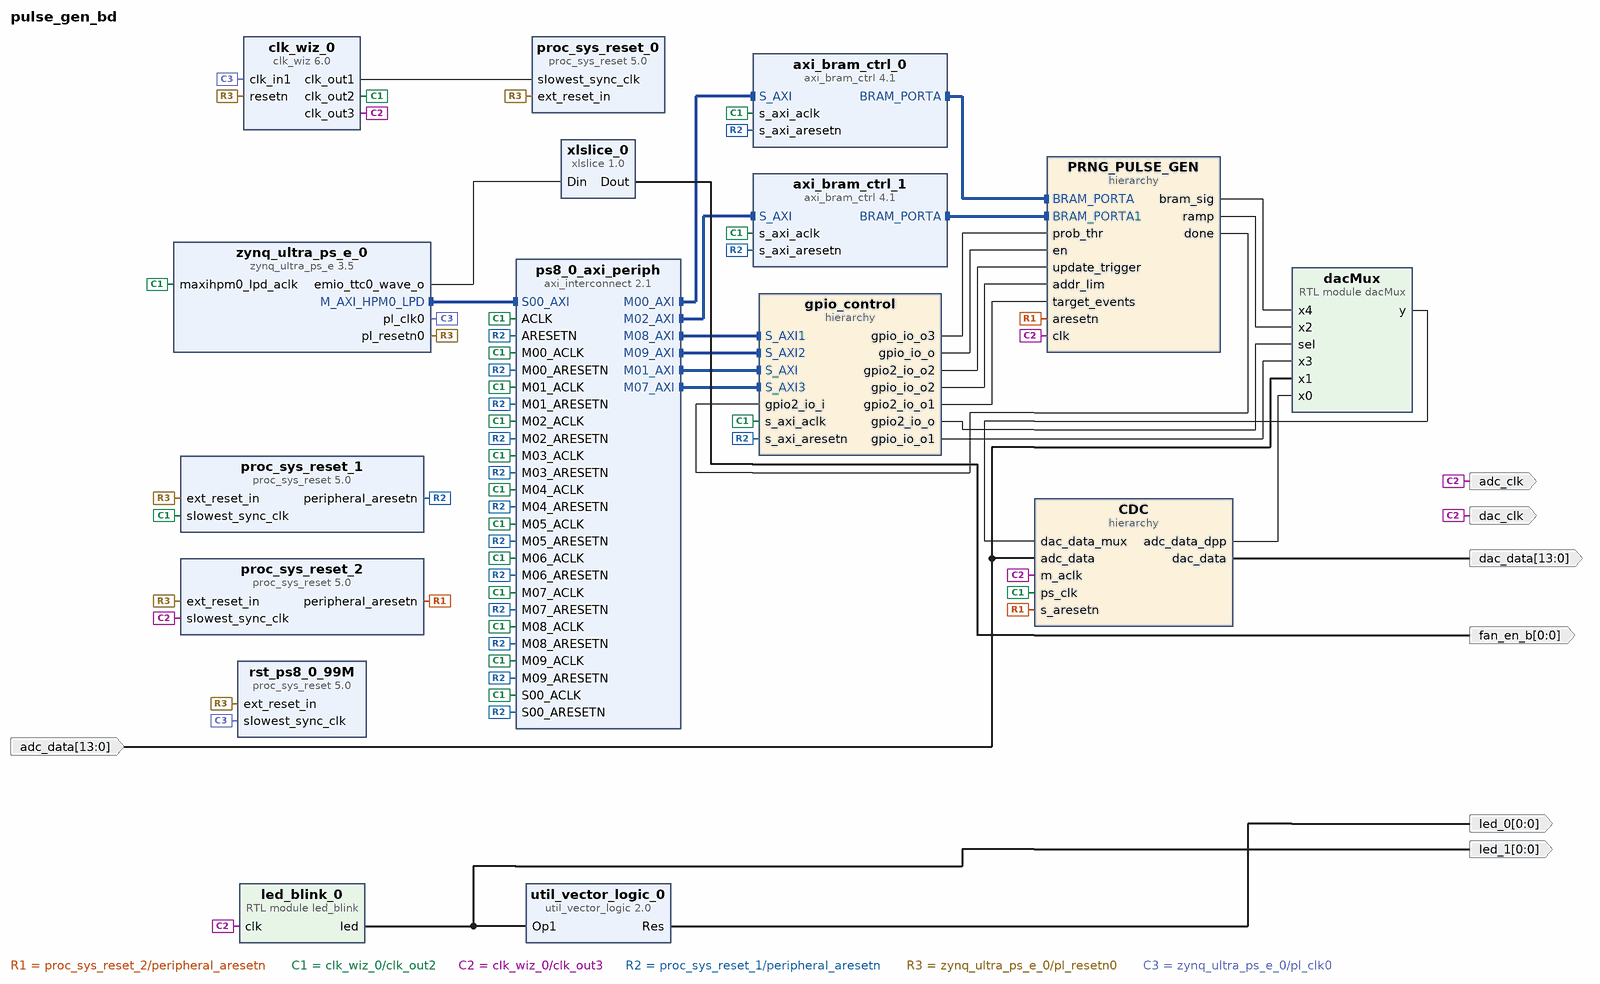
[diagram p0: block diagram of the top level]
# Vivado block design pulse_gen_bd, xck26-sfvc784-2LV-c, Vivado 2024.2
create_bd_design pulse_gen_bd

create_bd_port -dir O -from 0 -to 0 fan_en_b
create_bd_port -dir O -type clk adc_clk
create_bd_port -dir O -type clk dac_clk
create_bd_port -dir O -from 13 -to 0 dac_data
create_bd_port -dir O -from 0 -to 0 led_0
create_bd_port -dir I -from 13 -to 0 adc_data
create_bd_port -dir O -from 0 -to 0 led_1

create_bd_cell -type hier CDC
create_bd_cell -type ip -vlnv xilinx.com:ip:xlslice:1.0 xlslice_0
set_property -dict {CONFIG.DIN_FROM 2 CONFIG.DIN_TO 2 CONFIG.DIN_WIDTH 3} [get_bd_cells xlslice_0]
create_bd_cell -type module -reference dacMux dacMux
create_bd_cell -type ip -vlnv xilinx.com:ip:clk_wiz:6.0 clk_wiz_0
set_property -dict [list \
  CONFIG.CLKOUT1_JITTER 115.833 \
  CONFIG.CLKOUT1_PHASE_ERROR 87.181 \
  CONFIG.CLKOUT2_JITTER 102.087 \
  CONFIG.CLKOUT2_PHASE_ERROR 87.181 \
  CONFIG.CLKOUT2_REQUESTED_OUT_FREQ 200.000 \
  CONFIG.CLKOUT2_USED true \
  CONFIG.CLKOUT3_JITTER 132.685 \
  CONFIG.CLKOUT3_PHASE_ERROR 87.181 \
  CONFIG.CLKOUT3_REQUESTED_OUT_FREQ 50.000 \
  CONFIG.CLKOUT3_USED true \
  CONFIG.CLKOUT4_JITTER 188.587 \
  CONFIG.CLKOUT4_PHASE_ERROR 87.181 \
  CONFIG.CLKOUT4_REQUESTED_OUT_FREQ 100.000 \
  CONFIG.CLKOUT4_USED false \
  CONFIG.MMCM_CLKOUT1_DIVIDE 6 \
  CONFIG.MMCM_CLKOUT2_DIVIDE 24 \
  CONFIG.MMCM_CLKOUT3_DIVIDE 1 \
  CONFIG.NUM_OUT_CLKS 3 \
  CONFIG.RESET_PORT resetn \
  CONFIG.RESET_TYPE ACTIVE_LOW \
] [get_bd_cells clk_wiz_0]
create_bd_cell -type ip -vlnv xilinx.com:ip:util_vector_logic:2.0 util_vector_logic_0
set_property -dict {CONFIG.C_OPERATION not CONFIG.C_SIZE 1} [get_bd_cells util_vector_logic_0]
create_bd_cell -type module -reference led_blink led_blink_0
create_bd_cell -type hier PRNG_PULSE_GEN
create_bd_cell -type ip -vlnv xilinx.com:ip:zynq_ultra_ps_e:3.5 zynq_ultra_ps_e_0
set_property -dict [list \
  CONFIG.CAN0_BOARD_INTERFACE custom \
  CONFIG.CAN1_BOARD_INTERFACE custom \
  CONFIG.CSU_BOARD_INTERFACE custom \
  CONFIG.DP_BOARD_INTERFACE custom \
  CONFIG.GEM0_BOARD_INTERFACE custom \
  CONFIG.GEM1_BOARD_INTERFACE custom \
  CONFIG.GEM2_BOARD_INTERFACE custom \
  CONFIG.GEM3_BOARD_INTERFACE custom \
  CONFIG.GPIO_BOARD_INTERFACE custom \
  CONFIG.IIC0_BOARD_INTERFACE custom \
  CONFIG.IIC1_BOARD_INTERFACE custom \
  CONFIG.NAND_BOARD_INTERFACE custom \
  CONFIG.PCIE_BOARD_INTERFACE custom \
  CONFIG.PJTAG_BOARD_INTERFACE custom \
  CONFIG.PMU_BOARD_INTERFACE custom \
  CONFIG.PSU_BANK_0_IO_STANDARD LVCMOS18 \
  CONFIG.PSU_BANK_1_IO_STANDARD LVCMOS18 \
  CONFIG.PSU_BANK_2_IO_STANDARD LVCMOS18 \
  CONFIG.PSU_BANK_3_IO_STANDARD LVCMOS18 \
  CONFIG.PSU_USB3__DUAL_CLOCK_ENABLE 1 \
  CONFIG.PSU__CAN1__PERIPHERAL__ENABLE 0 \
  CONFIG.PSU__CRF_APB__ACPU_CTRL__FREQMHZ 1333.333 \
  CONFIG.PSU__CRF_APB__ACPU_CTRL__SRCSEL APLL \
  CONFIG.PSU__CRF_APB__APLL_CTRL__SRCSEL PSS_REF_CLK \
  CONFIG.PSU__CRF_APB__APLL_FRAC_CFG__ENABLED 1 \
  CONFIG.PSU__CRF_APB__DBG_FPD_CTRL__FREQMHZ 250 \
  CONFIG.PSU__CRF_APB__DBG_FPD_CTRL__SRCSEL IOPLL \
  CONFIG.PSU__CRF_APB__DBG_TRACE_CTRL__FREQMHZ 250 \
  CONFIG.PSU__CRF_APB__DBG_TRACE_CTRL__SRCSEL IOPLL \
  CONFIG.PSU__CRF_APB__DBG_TSTMP_CTRL__FREQMHZ 250 \
  CONFIG.PSU__CRF_APB__DBG_TSTMP_CTRL__SRCSEL IOPLL \
  CONFIG.PSU__CRF_APB__DDR_CTRL__FREQMHZ 1200 \
  CONFIG.PSU__CRF_APB__DDR_CTRL__SRCSEL DPLL \
  CONFIG.PSU__CRF_APB__DPDMA_REF_CTRL__FREQMHZ 600 \
  CONFIG.PSU__CRF_APB__DPDMA_REF_CTRL__SRCSEL APLL \
  CONFIG.PSU__CRF_APB__DPLL_CTRL__SRCSEL PSS_REF_CLK \
  CONFIG.PSU__CRF_APB__DP_AUDIO_REF_CTRL__SRCSEL RPLL \
  CONFIG.PSU__CRF_APB__DP_STC_REF_CTRL__SRCSEL RPLL \
  CONFIG.PSU__CRF_APB__DP_VIDEO_REF_CTRL__SRCSEL VPLL \
  CONFIG.PSU__CRF_APB__GDMA_REF_CTRL__FREQMHZ 600 \
  CONFIG.PSU__CRF_APB__GDMA_REF_CTRL__SRCSEL DPLL \
  CONFIG.PSU__CRF_APB__GPU_REF_CTRL__FREQMHZ 600 \
  CONFIG.PSU__CRF_APB__GPU_REF_CTRL__SRCSEL IOPLL \
  CONFIG.PSU__CRF_APB__TOPSW_LSBUS_CTRL__FREQMHZ 100 \
  CONFIG.PSU__CRF_APB__TOPSW_LSBUS_CTRL__SRCSEL IOPLL \
  CONFIG.PSU__CRF_APB__TOPSW_MAIN_CTRL__FREQMHZ 533.33 \
  CONFIG.PSU__CRF_APB__TOPSW_MAIN_CTRL__SRCSEL DPLL \
  CONFIG.PSU__CRF_APB__VPLL_CTRL__SRCSEL PSS_REF_CLK \
  CONFIG.PSU__CRL_APB__ADMA_REF_CTRL__FREQMHZ 500 \
  CONFIG.PSU__CRL_APB__ADMA_REF_CTRL__SRCSEL IOPLL \
  CONFIG.PSU__CRL_APB__CAN1_REF_CTRL__FREQMHZ 100 \
  CONFIG.PSU__CRL_APB__CAN1_REF_CTRL__SRCSEL IOPLL \
  CONFIG.PSU__CRL_APB__CPU_R5_CTRL__FREQMHZ 533.333 \
  CONFIG.PSU__CRL_APB__CPU_R5_CTRL__SRCSEL RPLL \
  CONFIG.PSU__CRL_APB__DBG_LPD_CTRL__FREQMHZ 250 \
  CONFIG.PSU__CRL_APB__DBG_LPD_CTRL__SRCSEL IOPLL \
  CONFIG.PSU__CRL_APB__GEM3_REF_CTRL__FREQMHZ 125 \
  CONFIG.PSU__CRL_APB__GEM3_REF_CTRL__SRCSEL IOPLL \
  CONFIG.PSU__CRL_APB__I2C0_REF_CTRL__FREQMHZ 100 \
  CONFIG.PSU__CRL_APB__I2C0_REF_CTRL__SRCSEL IOPLL \
  CONFIG.PSU__CRL_APB__I2C1_REF_CTRL__FREQMHZ 100 \
  CONFIG.PSU__CRL_APB__I2C1_REF_CTRL__SRCSEL IOPLL \
  CONFIG.PSU__CRL_APB__IOPLL_CTRL__SRCSEL PSS_REF_CLK \
  CONFIG.PSU__CRL_APB__IOU_SWITCH_CTRL__FREQMHZ 250 \
  CONFIG.PSU__CRL_APB__IOU_SWITCH_CTRL__SRCSEL IOPLL \
  CONFIG.PSU__CRL_APB__LPD_LSBUS_CTRL__FREQMHZ 100 \
  CONFIG.PSU__CRL_APB__LPD_LSBUS_CTRL__SRCSEL IOPLL \
  CONFIG.PSU__CRL_APB__LPD_SWITCH_CTRL__FREQMHZ 500 \
  CONFIG.PSU__CRL_APB__LPD_SWITCH_CTRL__SRCSEL IOPLL \
  CONFIG.PSU__CRL_APB__PCAP_CTRL__FREQMHZ 200 \
  CONFIG.PSU__CRL_APB__PCAP_CTRL__SRCSEL IOPLL \
  CONFIG.PSU__CRL_APB__PL0_REF_CTRL__FREQMHZ 100 \
  CONFIG.PSU__CRL_APB__PL0_REF_CTRL__SRCSEL IOPLL \
  CONFIG.PSU__CRL_APB__PL1_REF_CTRL__SRCSEL IOPLL \
  CONFIG.PSU__CRL_APB__QSPI_REF_CTRL__FREQMHZ 125 \
  CONFIG.PSU__CRL_APB__QSPI_REF_CTRL__SRCSEL IOPLL \
  CONFIG.PSU__CRL_APB__RPLL_CTRL__SRCSEL PSS_REF_CLK \
  CONFIG.PSU__CRL_APB__SDIO1_REF_CTRL__FREQMHZ 200 \
  CONFIG.PSU__CRL_APB__SDIO1_REF_CTRL__SRCSEL RPLL \
  CONFIG.PSU__CRL_APB__SPI1_REF_CTRL__SRCSEL IOPLL \
  CONFIG.PSU__CRL_APB__TIMESTAMP_REF_CTRL__FREQMHZ 100 \
  CONFIG.PSU__CRL_APB__TIMESTAMP_REF_CTRL__SRCSEL IOPLL \
  CONFIG.PSU__CRL_APB__UART0_REF_CTRL__FREQMHZ 100 \
  CONFIG.PSU__CRL_APB__UART0_REF_CTRL__SRCSEL IOPLL \
  CONFIG.PSU__CRL_APB__UART1_REF_CTRL__FREQMHZ 100 \
  CONFIG.PSU__CRL_APB__UART1_REF_CTRL__SRCSEL IOPLL \
  CONFIG.PSU__CRL_APB__USB0_BUS_REF_CTRL__FREQMHZ 250 \
  CONFIG.PSU__CRL_APB__USB0_BUS_REF_CTRL__SRCSEL IOPLL \
  CONFIG.PSU__CRL_APB__USB3_DUAL_REF_CTRL__FREQMHZ 20 \
  CONFIG.PSU__CRL_APB__USB3_DUAL_REF_CTRL__SRCSEL IOPLL \
  CONFIG.PSU__CRL_APB__USB3__ENABLE 0 \
  CONFIG.PSU__CSUPMU__PERIPHERAL__VALID 1 \
  CONFIG.PSU__DDRC__BUS_WIDTH {64 Bit} \
  CONFIG.PSU__DDRC__COMPONENTS Components \
  CONFIG.PSU__DDRC__DEVICE_CAPACITY {8192 MBits} \
  CONFIG.PSU__DDRC__DRAM_WIDTH {16 Bits} \
  CONFIG.PSU__DDRC__ECC Disabled \
  CONFIG.PSU__DDRC__MEMORY_TYPE {DDR 4} \
  CONFIG.PSU__DDRC__SPEED_BIN DDR4_2400R \
  CONFIG.PSU__DDR_HIGH_ADDRESS_GUI_ENABLE 1 \
  CONFIG.PSU__DDR__INTERFACE__FREQMHZ 600.000 \
  CONFIG.PSU__DEVICE_TYPE EV \
  CONFIG.PSU__DISPLAYPORT__PERIPHERAL__ENABLE 0 \
  CONFIG.PSU__DLL__ISUSED 0 \
  CONFIG.PSU__ENET1__GRP_MDIO__ENABLE 1 \
  CONFIG.PSU__ENET1__GRP_MDIO__IO {MIO 50 .. 51} \
  CONFIG.PSU__ENET1__PERIPHERAL__ENABLE 1 \
  CONFIG.PSU__ENET1__PERIPHERAL__IO {MIO 38 .. 49} \
  CONFIG.PSU__ENET3__PERIPHERAL__ENABLE 0 \
  CONFIG.PSU__FPGA_PL0_ENABLE 1 \
  CONFIG.PSU__FPGA_PL1_ENABLE 1 \
  CONFIG.PSU__GEM__TSU__ENABLE 0 \
  CONFIG.PSU__GPIO0_MIO__IO {MIO 0 .. 25} \
  CONFIG.PSU__GPIO0_MIO__PERIPHERAL__ENABLE 1 \
  CONFIG.PSU__GPIO1_MIO__IO {MIO 26 .. 51} \
  CONFIG.PSU__GPIO1_MIO__PERIPHERAL__ENABLE 1 \
  CONFIG.PSU__GPIO_EMIO__WIDTH {[91:0]} \
  CONFIG.PSU__I2C0__PERIPHERAL__ENABLE 0 \
  CONFIG.PSU__I2C1__PERIPHERAL__ENABLE 1 \
  CONFIG.PSU__I2C1__PERIPHERAL__IO {MIO 24 .. 25} \
  CONFIG.PSU__IOU_SLCR__IOU_TTC_APB_CLK__TTC0_SEL APB \
  CONFIG.PSU__IOU_SLCR__IOU_TTC_APB_CLK__TTC1_SEL APB \
  CONFIG.PSU__IOU_SLCR__IOU_TTC_APB_CLK__TTC2_SEL APB \
  CONFIG.PSU__IOU_SLCR__IOU_TTC_APB_CLK__TTC3_SEL APB \
  CONFIG.PSU__NUM_FABRIC_RESETS 4 \
  CONFIG.PSU__OVERRIDE_HPX_QOS 0 \
  CONFIG.PSU__OVERRIDE__BASIC_CLOCK 0 \
  CONFIG.PSU__PMU_COHERENCY 0 \
  CONFIG.PSU__PMU__AIBACK__ENABLE 0 \
  CONFIG.PSU__PMU__EMIO_GPI__ENABLE 0 \
  CONFIG.PSU__PMU__EMIO_GPO__ENABLE 0 \
  CONFIG.PSU__PMU__GPI0__ENABLE 1 \
  CONFIG.PSU__PMU__GPI0__IO {MIO 26} \
  CONFIG.PSU__PMU__GPI1__ENABLE 0 \
  CONFIG.PSU__PMU__GPI2__ENABLE 0 \
  CONFIG.PSU__PMU__GPI3__ENABLE 0 \
  CONFIG.PSU__PMU__GPI4__ENABLE 0 \
  CONFIG.PSU__PMU__GPI5__ENABLE 1 \
  CONFIG.PSU__PMU__GPI5__IO {MIO 31} \
  CONFIG.PSU__PMU__GPO0__ENABLE 1 \
  CONFIG.PSU__PMU__GPO0__IO {MIO 32} \
  CONFIG.PSU__PMU__GPO1__ENABLE 1 \
  CONFIG.PSU__PMU__GPO1__IO {MIO 33} \
  CONFIG.PSU__PMU__GPO2__ENABLE 1 \
  CONFIG.PSU__PMU__GPO2__IO {MIO 34} \
  CONFIG.PSU__PMU__GPO2__POLARITY high \
  CONFIG.PSU__PMU__GPO3__ENABLE 1 \
  CONFIG.PSU__PMU__GPO3__IO {MIO 35} \
  CONFIG.PSU__PMU__GPO3__POLARITY low \
  CONFIG.PSU__PMU__GPO4__ENABLE 0 \
  CONFIG.PSU__PMU__GPO5__ENABLE 0 \
  CONFIG.PSU__PMU__PERIPHERAL__ENABLE 1 \
  CONFIG.PSU__PMU__PLERROR__ENABLE 0 \
  CONFIG.PSU__PRESET_APPLIED 1 \
  CONFIG.PSU__PSS_REF_CLK__FREQMHZ 33.333 \
  CONFIG.PSU__QSPI_COHERENCY 0 \
  CONFIG.PSU__QSPI_ROUTE_THROUGH_FPD 0 \
  CONFIG.PSU__QSPI__GRP_FBCLK__ENABLE 0 \
  CONFIG.PSU__QSPI__PERIPHERAL__DATA_MODE x4 \
  CONFIG.PSU__QSPI__PERIPHERAL__ENABLE 1 \
  CONFIG.PSU__QSPI__PERIPHERAL__IO {MIO 0 .. 5} \
  CONFIG.PSU__QSPI__PERIPHERAL__MODE Single \
  CONFIG.PSU__SATA__PERIPHERAL__ENABLE 0 \
  CONFIG.PSU__SD0__CLK_100_SDR_OTAP_DLY 0x3 \
  CONFIG.PSU__SD0__CLK_200_SDR_OTAP_DLY 0x3 \
  CONFIG.PSU__SD0__CLK_50_DDR_ITAP_DLY 0x3D \
  CONFIG.PSU__SD0__CLK_50_DDR_OTAP_DLY 0x4 \
  CONFIG.PSU__SD0__CLK_50_SDR_ITAP_DLY 0x15 \
  CONFIG.PSU__SD0__CLK_50_SDR_OTAP_DLY 0x5 \
  CONFIG.PSU__SD1__CLK_100_SDR_OTAP_DLY 0x3 \
  CONFIG.PSU__SD1__CLK_200_SDR_OTAP_DLY 0x3 \
  CONFIG.PSU__SD1__CLK_50_DDR_ITAP_DLY 0x3D \
  CONFIG.PSU__SD1__CLK_50_DDR_OTAP_DLY 0x4 \
  CONFIG.PSU__SD1__CLK_50_SDR_ITAP_DLY 0x15 \
  CONFIG.PSU__SD1__CLK_50_SDR_OTAP_DLY 0x5 \
  CONFIG.PSU__SD1__PERIPHERAL__ENABLE 0 \
  CONFIG.PSU__SPI1__GRP_SS0__IO {MIO 9} \
  CONFIG.PSU__SPI1__PERIPHERAL__ENABLE 1 \
  CONFIG.PSU__SPI1__PERIPHERAL__IO {MIO 6 .. 11} \
  CONFIG.PSU__SWDT0__CLOCK__ENABLE 0 \
  CONFIG.PSU__SWDT0__PERIPHERAL__ENABLE 1 \
  CONFIG.PSU__SWDT0__RESET__ENABLE 0 \
  CONFIG.PSU__SWDT1__CLOCK__ENABLE 0 \
  CONFIG.PSU__SWDT1__PERIPHERAL__ENABLE 1 \
  CONFIG.PSU__SWDT1__RESET__ENABLE 0 \
  CONFIG.PSU__TSU__BUFG_PORT_PAIR 0 \
  CONFIG.PSU__TTC0__CLOCK__ENABLE 0 \
  CONFIG.PSU__TTC0__PERIPHERAL__ENABLE 1 \
  CONFIG.PSU__TTC0__WAVEOUT__ENABLE 1 \
  CONFIG.PSU__TTC0__WAVEOUT__IO EMIO \
  CONFIG.PSU__TTC1__CLOCK__ENABLE 0 \
  CONFIG.PSU__TTC1__PERIPHERAL__ENABLE 1 \
  CONFIG.PSU__TTC1__WAVEOUT__ENABLE 0 \
  CONFIG.PSU__TTC2__CLOCK__ENABLE 0 \
  CONFIG.PSU__TTC2__PERIPHERAL__ENABLE 1 \
  CONFIG.PSU__TTC2__WAVEOUT__ENABLE 0 \
  CONFIG.PSU__TTC3__CLOCK__ENABLE 0 \
  CONFIG.PSU__TTC3__PERIPHERAL__ENABLE 1 \
  CONFIG.PSU__TTC3__WAVEOUT__ENABLE 0 \
  CONFIG.PSU__UART0__PERIPHERAL__ENABLE 0 \
  CONFIG.PSU__UART1__BAUD_RATE 115200 \
  CONFIG.PSU__UART1__MODEM__ENABLE 0 \
  CONFIG.PSU__UART1__PERIPHERAL__ENABLE 1 \
  CONFIG.PSU__UART1__PERIPHERAL__IO {MIO 36 .. 37} \
  CONFIG.PSU__USB0_COHERENCY 0 \
  CONFIG.PSU__USB0__PERIPHERAL__ENABLE 1 \
  CONFIG.PSU__USB0__PERIPHERAL__IO {MIO 52 .. 63} \
  CONFIG.PSU__USB0__RESET__ENABLE 1 \
  CONFIG.PSU__USB0__RESET__IO {MIO 76} \
  CONFIG.PSU__USB1__PERIPHERAL__ENABLE 1 \
  CONFIG.PSU__USB1__PERIPHERAL__IO {MIO 64 .. 75} \
  CONFIG.PSU__USB1__RESET__ENABLE 1 \
  CONFIG.PSU__USB1__RESET__IO {MIO 77} \
  CONFIG.PSU__USB2_0__EMIO__ENABLE 0 \
  CONFIG.PSU__USB3_0__PERIPHERAL__ENABLE 0 \
  CONFIG.PSU__USB__RESET__MODE {Separate MIO Pin} \
  CONFIG.PSU__USB__RESET__POLARITY {Active Low} \
  CONFIG.PSU__USE__IRQ0 1 \
  CONFIG.PSU__USE__M_AXI_GP0 0 \
  CONFIG.PSU__USE__M_AXI_GP1 0 \
  CONFIG.PSU__USE__M_AXI_GP2 1 \
  CONFIG.QSPI_BOARD_INTERFACE custom \
  CONFIG.SATA_BOARD_INTERFACE custom \
  CONFIG.SD0_BOARD_INTERFACE custom \
  CONFIG.SD1_BOARD_INTERFACE custom \
  CONFIG.SPI0_BOARD_INTERFACE custom \
  CONFIG.SPI1_BOARD_INTERFACE custom \
  CONFIG.SUBPRESET1 Custom \
  CONFIG.SUBPRESET2 Custom \
  CONFIG.SWDT0_BOARD_INTERFACE custom \
  CONFIG.SWDT1_BOARD_INTERFACE custom \
  CONFIG.TRACE_BOARD_INTERFACE custom \
  CONFIG.TTC0_BOARD_INTERFACE custom \
  CONFIG.TTC1_BOARD_INTERFACE custom \
  CONFIG.TTC2_BOARD_INTERFACE custom \
  CONFIG.TTC3_BOARD_INTERFACE custom \
  CONFIG.UART0_BOARD_INTERFACE custom \
  CONFIG.UART1_BOARD_INTERFACE custom \
  CONFIG.USB0_BOARD_INTERFACE custom \
  CONFIG.USB1_BOARD_INTERFACE custom \
  CONFIG.preset None \
] [get_bd_cells zynq_ultra_ps_e_0]
# 740 more settings of zynq_ultra_ps_e_0 are not shown: defaults, MIO pin electricals, DDR timing, and values the tool derives
create_bd_cell -type ip -vlnv xilinx.com:ip:proc_sys_reset:5.0 proc_sys_reset_1
create_bd_cell -type ip -vlnv xilinx.com:ip:proc_sys_reset:5.0 rst_ps8_0_99M
create_bd_cell -type ip -vlnv xilinx.com:ip:proc_sys_reset:5.0 proc_sys_reset_0
create_bd_cell -type ip -vlnv xilinx.com:ip:axi_interconnect:2.1 ps8_0_axi_periph
set_property -dict {CONFIG.NUM_MI 10} [get_bd_cells ps8_0_axi_periph]
create_bd_cell -type hier gpio_control
create_bd_cell -type ip -vlnv xilinx.com:ip:axi_bram_ctrl:4.1 axi_bram_ctrl_0
set_property -dict {CONFIG.SINGLE_PORT_BRAM 1} [get_bd_cells axi_bram_ctrl_0]
create_bd_cell -type ip -vlnv xilinx.com:ip:axi_bram_ctrl:4.1 axi_bram_ctrl_1
set_property -dict {CONFIG.SINGLE_PORT_BRAM 1} [get_bd_cells axi_bram_ctrl_1]
create_bd_cell -type ip -vlnv xilinx.com:ip:proc_sys_reset:5.0 proc_sys_reset_2

# ---- hierarchy /CDC ----
current_bd_instance /CDC
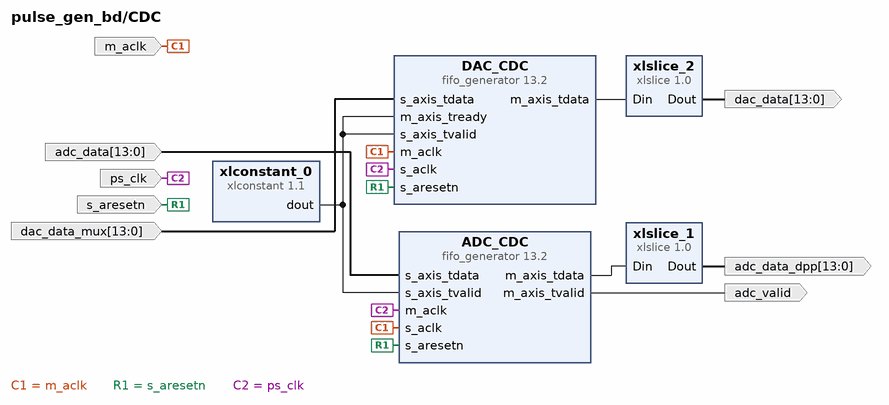
[diagram p1: block diagram inside /CDC]
create_bd_pin -dir I -type rst s_aresetn
create_bd_pin -dir I -type clk ps_clk
create_bd_pin -dir I -from 13 -to 0 adc_data
create_bd_pin -dir O -from 13 -to 0 dac_data
create_bd_pin -dir I -from 13 -to 0 dac_data_mux
create_bd_pin -dir O -from 13 -to 0 adc_data_dpp
create_bd_pin -dir O adc_valid
create_bd_pin -dir I -type clk m_aclk

create_bd_cell -type ip -vlnv xilinx.com:ip:fifo_generator:13.2 ADC_CDC
set_property -dict [list \
  CONFIG.Clock_Type_AXI Independent_Clock \
  CONFIG.FIFO_Implementation_axis Independent_Clocks_Block_RAM \
  CONFIG.FIFO_Implementation_rach Independent_Clocks_Distributed_RAM \
  CONFIG.FIFO_Implementation_rdch Independent_Clocks_Builtin_FIFO \
  CONFIG.FIFO_Implementation_wach Independent_Clocks_Distributed_RAM \
  CONFIG.FIFO_Implementation_wdch Independent_Clocks_Builtin_FIFO \
  CONFIG.FIFO_Implementation_wrch Independent_Clocks_Distributed_RAM \
  CONFIG.INTERFACE_TYPE AXI_STREAM \
  CONFIG.Input_Depth_axis 16 \
  CONFIG.TDATA_NUM_BYTES 2 \
  CONFIG.TUSER_WIDTH 0 \
] [get_bd_cells ADC_CDC]
create_bd_cell -type ip -vlnv xilinx.com:ip:xlslice:1.0 xlslice_1
set_property -dict {CONFIG.DIN_FROM 13 CONFIG.DIN_WIDTH 16 CONFIG.DOUT_WIDTH 14} [get_bd_cells xlslice_1]
create_bd_cell -type ip -vlnv xilinx.com:ip:xlslice:1.0 xlslice_2
set_property -dict {CONFIG.DIN_FROM 13 CONFIG.DIN_WIDTH 28 CONFIG.DOUT_WIDTH 14} [get_bd_cells xlslice_2]
create_bd_cell -type ip -vlnv xilinx.com:ip:fifo_generator:13.2 DAC_CDC
set_property -dict [list \
  CONFIG.Clock_Type_AXI Independent_Clock \
  CONFIG.FIFO_Implementation_axis Independent_Clocks_Block_RAM \
  CONFIG.FIFO_Implementation_rach Independent_Clocks_Distributed_RAM \
  CONFIG.FIFO_Implementation_rdch Independent_Clocks_Builtin_FIFO \
  CONFIG.FIFO_Implementation_wach Independent_Clocks_Distributed_RAM \
  CONFIG.FIFO_Implementation_wdch Independent_Clocks_Builtin_FIFO \
  CONFIG.FIFO_Implementation_wrch Independent_Clocks_Distributed_RAM \
  CONFIG.INTERFACE_TYPE AXI_STREAM \
  CONFIG.Input_Depth_axis 16 \
  CONFIG.TDATA_NUM_BYTES 2 \
  CONFIG.TUSER_WIDTH 0 \
] [get_bd_cells DAC_CDC]
create_bd_cell -type ip -vlnv xilinx.com:ip:xlconstant:1.1 xlconstant_0

# ---- hierarchy /PRNG_PULSE_GEN ----
current_bd_instance /PRNG_PULSE_GEN
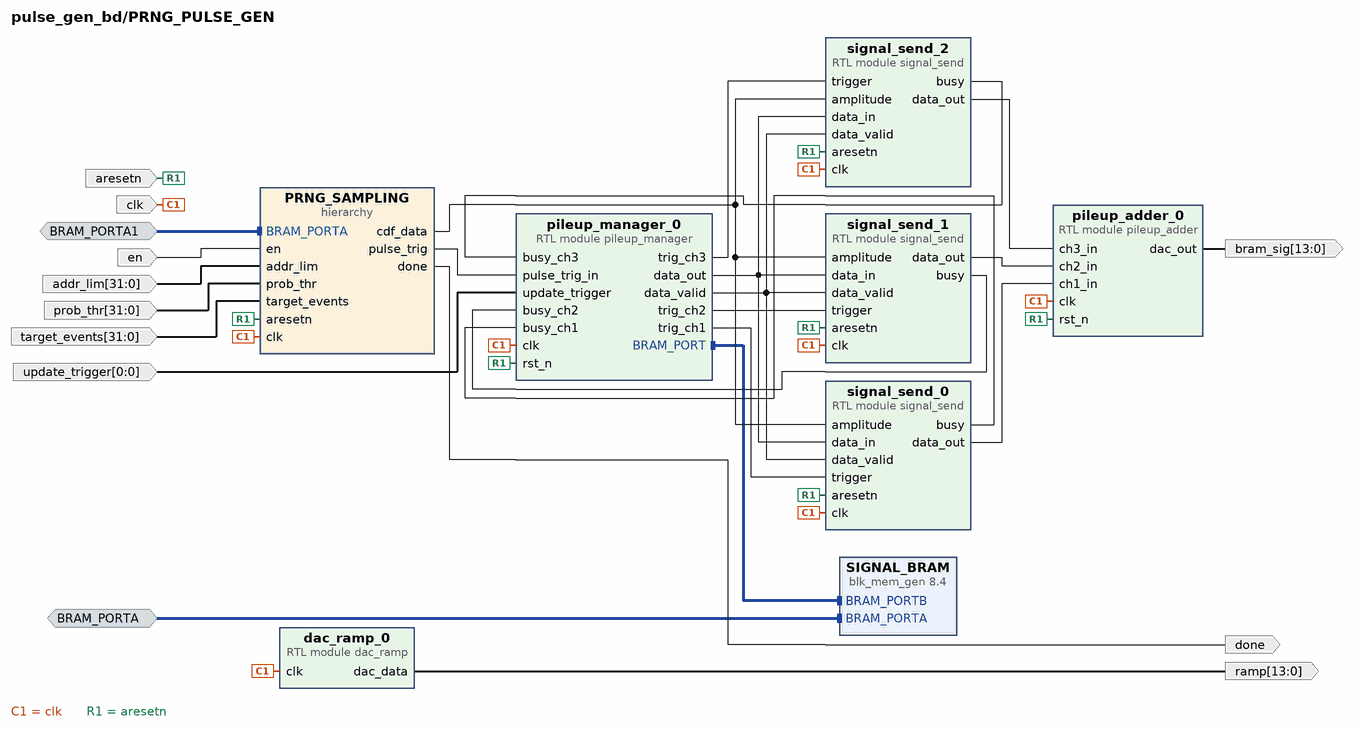
[diagram p2: block diagram inside /PRNG_PULSE_GEN]
create_bd_intf_pin -mode Slave -vlnv xilinx.com:interface:bram_rtl:1.0 BRAM_PORTA
create_bd_intf_pin -mode Slave -vlnv xilinx.com:interface:bram_rtl:1.0 BRAM_PORTA1
create_bd_pin -dir I -type clk clk
create_bd_pin -dir I -type rst aresetn
create_bd_pin -dir O done
create_bd_pin -dir I -from 31 -to 0 target_events
create_bd_pin -dir I -from 31 -to 0 prob_thr
create_bd_pin -dir I en
create_bd_pin -dir O -from 13 -to 0 ramp
create_bd_pin -dir O -from 13 -to 0 bram_sig
create_bd_pin -dir I -from 31 -to 0 addr_lim
create_bd_pin -dir I -from 0 -to 0 update_trigger

create_bd_cell -type module -reference dac_ramp dac_ramp_0
create_bd_cell -type ip -vlnv xilinx.com:ip:blk_mem_gen:8.4 SIGNAL_BRAM
set_property -dict {CONFIG.Memory_Type True_Dual_Port_RAM} [get_bd_cells SIGNAL_BRAM]
create_bd_cell -type module -reference pileup_manager pileup_manager_0
create_bd_cell -type module -reference signal_send signal_send_0
create_bd_cell -type module -reference signal_send signal_send_1
create_bd_cell -type module -reference pileup_adder pileup_adder_0
create_bd_cell -type hier PRNG_SAMPLING
create_bd_cell -type module -reference signal_send signal_send_2

# ---- hierarchy /PRNG_PULSE_GEN/PRNG_SAMPLING ----
current_bd_instance /PRNG_PULSE_GEN/PRNG_SAMPLING
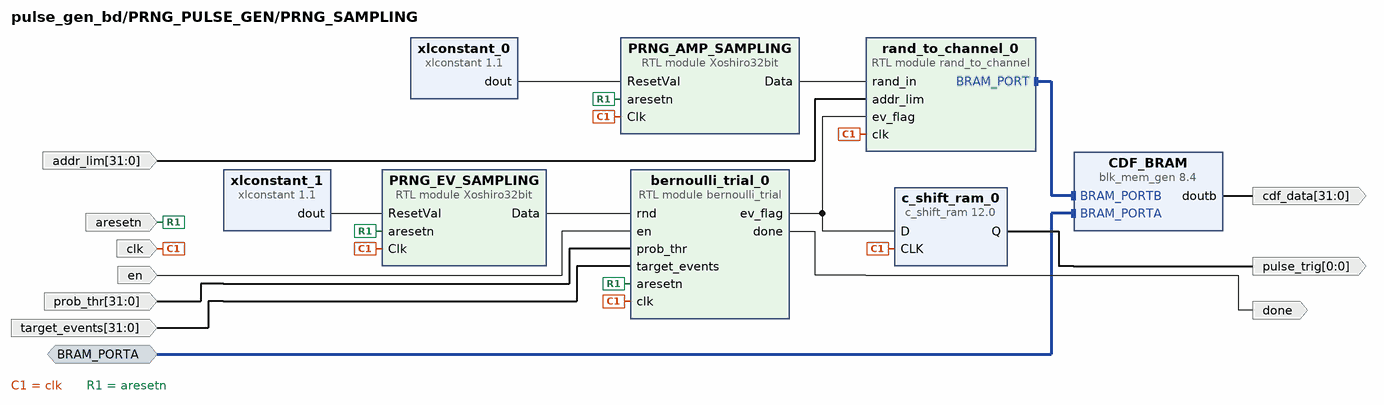
[diagram p3: block diagram inside /PRNG_PULSE_GEN/PRNG_SAMPLING]
create_bd_intf_pin -mode Slave -vlnv xilinx.com:interface:bram_rtl:1.0 BRAM_PORTA
create_bd_pin -dir I -type clk clk
create_bd_pin -dir I -type rst aresetn
create_bd_pin -dir I en
create_bd_pin -dir I -from 31 -to 0 prob_thr
create_bd_pin -dir I -from 31 -to 0 target_events
create_bd_pin -dir O done
create_bd_pin -dir I -from 31 -to 0 addr_lim
create_bd_pin -dir O -from 31 -to 0 cdf_data
create_bd_pin -dir O -from 0 -to 0 -type data pulse_trig

create_bd_cell -type module -reference Xoshiro32bit PRNG_EV_SAMPLING
create_bd_cell -type module -reference bernoulli_trial bernoulli_trial_0
create_bd_cell -type ip -vlnv xilinx.com:ip:xlconstant:1.1 xlconstant_0
set_property -dict {CONFIG.CONST_VAL 24197857200151252728969465425480056815 CONFIG.CONST_WIDTH 128} [get_bd_cells xlconstant_0]
create_bd_cell -type ip -vlnv xilinx.com:ip:xlconstant:1.1 xlconstant_1
set_property -dict {CONFIG.CONST_VAL 24197857200151252728969465429440056815 CONFIG.CONST_WIDTH 128} [get_bd_cells xlconstant_1]
create_bd_cell -type module -reference rand_to_channel rand_to_channel_0
create_bd_cell -type module -reference Xoshiro32bit PRNG_AMP_SAMPLING
create_bd_cell -type ip -vlnv xilinx.com:ip:blk_mem_gen:8.4 CDF_BRAM
set_property -dict {CONFIG.Memory_Type True_Dual_Port_RAM} [get_bd_cells CDF_BRAM]
create_bd_cell -type ip -vlnv xilinx.com:ip:c_shift_ram:12.0 c_shift_ram_0
set_property -dict {CONFIG.Depth 1 CONFIG.Width 1} [get_bd_cells c_shift_ram_0]

# ---- hierarchy /gpio_control ----
current_bd_instance /gpio_control
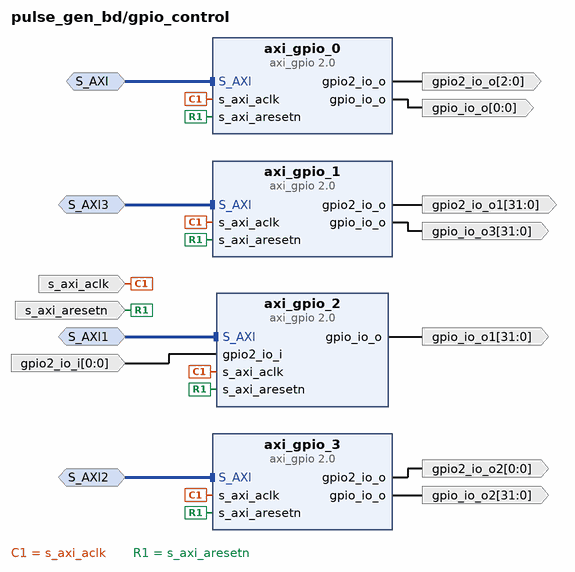
[diagram p4: block diagram inside /gpio_control]
create_bd_intf_pin -mode Slave -vlnv xilinx.com:interface:aximm_rtl:1.0 S_AXI
create_bd_intf_pin -mode Slave -vlnv xilinx.com:interface:aximm_rtl:1.0 S_AXI1
create_bd_intf_pin -mode Slave -vlnv xilinx.com:interface:aximm_rtl:1.0 S_AXI2
create_bd_intf_pin -mode Slave -vlnv xilinx.com:interface:aximm_rtl:1.0 S_AXI3
create_bd_pin -dir I -type clk s_axi_aclk
create_bd_pin -dir I -type rst s_axi_aresetn
create_bd_pin -dir O -from 0 -to 0 gpio_io_o
create_bd_pin -dir O -from 2 -to 0 gpio2_io_o
create_bd_pin -dir O -from 31 -to 0 gpio_io_o1
create_bd_pin -dir I -from 0 -to 0 gpio2_io_i
create_bd_pin -dir O -from 31 -to 0 gpio_io_o3
create_bd_pin -dir O -from 31 -to 0 gpio2_io_o1
create_bd_pin -dir O -from 31 -to 0 gpio_io_o2
create_bd_pin -dir O -from 0 -to 0 gpio2_io_o2

create_bd_cell -type ip -vlnv xilinx.com:ip:axi_gpio:2.0 axi_gpio_0
set_property -dict [list \
  CONFIG.C_ALL_OUTPUTS 1 \
  CONFIG.C_ALL_OUTPUTS_2 1 \
  CONFIG.C_GPIO2_WIDTH 3 \
  CONFIG.C_GPIO_WIDTH 1 \
  CONFIG.C_IS_DUAL 1 \
] [get_bd_cells axi_gpio_0]
create_bd_cell -type ip -vlnv xilinx.com:ip:axi_gpio:2.0 axi_gpio_2
set_property -dict [list \
  CONFIG.C_ALL_INPUTS_2 1 \
  CONFIG.C_ALL_OUTPUTS 1 \
  CONFIG.C_GPIO2_WIDTH 1 \
  CONFIG.C_IS_DUAL 1 \
] [get_bd_cells axi_gpio_2]
create_bd_cell -type ip -vlnv xilinx.com:ip:axi_gpio:2.0 axi_gpio_3
set_property -dict [list \
  CONFIG.C_ALL_OUTPUTS 1 \
  CONFIG.C_ALL_OUTPUTS_2 1 \
  CONFIG.C_GPIO2_WIDTH 1 \
  CONFIG.C_GPIO_WIDTH 32 \
  CONFIG.C_IS_DUAL 1 \
] [get_bd_cells axi_gpio_3]
create_bd_cell -type ip -vlnv xilinx.com:ip:axi_gpio:2.0 axi_gpio_1
set_property -dict [list \
  CONFIG.C_ALL_OUTPUTS 1 \
  CONFIG.C_ALL_OUTPUTS_2 1 \
  CONFIG.C_GPIO2_WIDTH 32 \
  CONFIG.C_GPIO_WIDTH 32 \
  CONFIG.C_IS_DUAL 1 \
] [get_bd_cells axi_gpio_1]

# ---- connections ----

current_bd_instance /CDC
connect_bd_net [get_bd_pins ADC_CDC/m_axis_tdata] [get_bd_pins xlslice_1/Din]
connect_bd_net [get_bd_pins ADC_CDC/m_axis_tvalid] [get_bd_pins adc_valid]
connect_bd_net [get_bd_pins DAC_CDC/m_axis_tdata] [get_bd_pins xlslice_2/Din]
connect_bd_net [get_bd_pins m_aclk] [get_bd_pins DAC_CDC/m_aclk] [get_bd_pins ADC_CDC/s_aclk]
connect_bd_net -net rst_ps8_0_99M_peripheral_aresetn [get_bd_pins s_aresetn] [get_bd_pins DAC_CDC/s_aresetn] [get_bd_pins ADC_CDC/s_aresetn]
connect_bd_net -net s_axis_tdata_0_1 [get_bd_pins adc_data] [get_bd_pins ADC_CDC/s_axis_tdata]
connect_bd_net -net s_axis_tdata_1 [get_bd_pins dac_data_mux] [get_bd_pins DAC_CDC/s_axis_tdata]
connect_bd_net [get_bd_pins xlconstant_0/dout] \
  [get_bd_pins DAC_CDC/s_axis_tvalid] [get_bd_pins DAC_CDC/m_axis_tready] [get_bd_pins ADC_CDC/s_axis_tvalid]
connect_bd_net [get_bd_pins xlslice_1/Dout] [get_bd_pins adc_data_dpp]
connect_bd_net [get_bd_pins xlslice_2/Dout] [get_bd_pins dac_data]
connect_bd_net -net zynq_ultra_ps_e_0_pl_clk0 [get_bd_pins ps_clk] [get_bd_pins DAC_CDC/s_aclk] [get_bd_pins ADC_CDC/m_aclk]

current_bd_instance /PRNG_PULSE_GEN
connect_bd_intf_net [get_bd_intf_pins SIGNAL_BRAM/BRAM_PORTA] [get_bd_intf_pins BRAM_PORTA]
connect_bd_intf_net [get_bd_intf_pins PRNG_SAMPLING/BRAM_PORTA] [get_bd_intf_pins BRAM_PORTA1]
connect_bd_intf_net [get_bd_intf_pins pileup_manager_0/BRAM_PORT] [get_bd_intf_pins SIGNAL_BRAM/BRAM_PORTB]
connect_bd_net [get_bd_pins PRNG_SAMPLING/cdf_data] \
  [get_bd_pins signal_send_0/amplitude] [get_bd_pins signal_send_1/amplitude] [get_bd_pins signal_send_2/amplitude]
connect_bd_net -net bernoulli_trial_0_done [get_bd_pins PRNG_SAMPLING/done] [get_bd_pins done]
connect_bd_net -net c_shift_ram_0_Q [get_bd_pins PRNG_SAMPLING/pulse_trig] [get_bd_pins pileup_manager_0/pulse_trig_in]
connect_bd_net -net clk_wiz_0_clk_out3 [get_bd_pins clk] \
  [get_bd_pins dac_ramp_0/clk] [get_bd_pins PRNG_SAMPLING/clk] [get_bd_pins pileup_manager_0/clk] \
  [get_bd_pins pileup_adder_0/clk] [get_bd_pins signal_send_0/clk] [get_bd_pins signal_send_1/clk] \
  [get_bd_pins signal_send_2/clk]
connect_bd_net [get_bd_pins dac_ramp_0/dac_data] [get_bd_pins ramp]
connect_bd_net -net en_0_1 [get_bd_pins en] [get_bd_pins PRNG_SAMPLING/en]
connect_bd_net -net max_val_1 [get_bd_pins addr_lim] [get_bd_pins PRNG_SAMPLING/addr_lim]
connect_bd_net [get_bd_pins pileup_adder_0/dac_out] [get_bd_pins bram_sig]
connect_bd_net [get_bd_pins pileup_manager_0/data_out] \
  [get_bd_pins signal_send_0/data_in] [get_bd_pins signal_send_1/data_in] [get_bd_pins signal_send_2/data_in]
connect_bd_net [get_bd_pins pileup_manager_0/data_valid] \
  [get_bd_pins signal_send_0/data_valid] [get_bd_pins signal_send_1/data_valid] [get_bd_pins signal_send_2/data_valid]
connect_bd_net [get_bd_pins pileup_manager_0/trig_ch1] [get_bd_pins signal_send_0/trigger]
connect_bd_net [get_bd_pins pileup_manager_0/trig_ch2] [get_bd_pins signal_send_1/trigger]
connect_bd_net [get_bd_pins pileup_manager_0/trig_ch3] [get_bd_pins signal_send_2/trigger]
connect_bd_net -net prob_thr_0_1 [get_bd_pins prob_thr] [get_bd_pins PRNG_SAMPLING/prob_thr]
connect_bd_net -net proc_sys_reset_1_peripheral_aresetn [get_bd_pins aresetn] \
  [get_bd_pins PRNG_SAMPLING/aresetn] [get_bd_pins pileup_manager_0/rst_n] [get_bd_pins pileup_adder_0/rst_n] \
  [get_bd_pins signal_send_0/aresetn] [get_bd_pins signal_send_1/aresetn] [get_bd_pins signal_send_2/aresetn]
connect_bd_net [get_bd_pins signal_send_0/busy] [get_bd_pins pileup_manager_0/busy_ch1]
connect_bd_net -net signal_send_0_dac_out [get_bd_pins signal_send_0/data_out] [get_bd_pins pileup_adder_0/ch1_in]
connect_bd_net [get_bd_pins signal_send_1/busy] [get_bd_pins pileup_manager_0/busy_ch2]
connect_bd_net -net signal_send_1_dac_out [get_bd_pins signal_send_1/data_out] [get_bd_pins pileup_adder_0/ch2_in]
connect_bd_net [get_bd_pins signal_send_2/busy] [get_bd_pins pileup_manager_0/busy_ch3]
connect_bd_net [get_bd_pins signal_send_2/data_out] [get_bd_pins pileup_adder_0/ch3_in]
connect_bd_net -net target_events_0_1 [get_bd_pins target_events] [get_bd_pins PRNG_SAMPLING/target_events]
connect_bd_net [get_bd_pins update_trigger] [get_bd_pins pileup_manager_0/update_trigger]

current_bd_instance /PRNG_PULSE_GEN/PRNG_SAMPLING
connect_bd_intf_net [get_bd_intf_pins BRAM_PORTA] [get_bd_intf_pins CDF_BRAM/BRAM_PORTA]
connect_bd_intf_net [get_bd_intf_pins rand_to_channel_0/BRAM_PORT] [get_bd_intf_pins CDF_BRAM/BRAM_PORTB]
connect_bd_net [get_bd_pins bernoulli_trial_0/ev_flag] [get_bd_pins c_shift_ram_0/D] [get_bd_pins rand_to_channel_0/ev_flag]
connect_bd_net [get_bd_pins CDF_BRAM/doutb] [get_bd_pins cdf_data]
connect_bd_net -net Xoshiro32bit_0_Data [get_bd_pins PRNG_AMP_SAMPLING/Data] [get_bd_pins rand_to_channel_0/rand_in]
connect_bd_net -net Xoshiro32bit_1_Data [get_bd_pins PRNG_EV_SAMPLING/Data] [get_bd_pins bernoulli_trial_0/rnd]
connect_bd_net [get_bd_pins bernoulli_trial_0/done] [get_bd_pins done]
connect_bd_net [get_bd_pins c_shift_ram_0/Q] [get_bd_pins pulse_trig]
connect_bd_net -net clk_wiz_0_clk_out3 [get_bd_pins clk] \
  [get_bd_pins c_shift_ram_0/CLK] [get_bd_pins PRNG_AMP_SAMPLING/Clk] [get_bd_pins bernoulli_trial_0/clk] \
  [get_bd_pins rand_to_channel_0/clk] [get_bd_pins PRNG_EV_SAMPLING/Clk]
connect_bd_net -net en_0_1 [get_bd_pins en] [get_bd_pins bernoulli_trial_0/en]
connect_bd_net -net max_val_1 [get_bd_pins addr_lim] [get_bd_pins rand_to_channel_0/addr_lim]
connect_bd_net -net prob_thr_0_1 [get_bd_pins prob_thr] [get_bd_pins bernoulli_trial_0/prob_thr]
connect_bd_net -net proc_sys_reset_1_peripheral_aresetn [get_bd_pins aresetn] \
  [get_bd_pins PRNG_AMP_SAMPLING/aresetn] [get_bd_pins bernoulli_trial_0/aresetn] [get_bd_pins PRNG_EV_SAMPLING/aresetn]
connect_bd_net -net target_events_0_1 [get_bd_pins target_events] [get_bd_pins bernoulli_trial_0/target_events]
connect_bd_net [get_bd_pins xlconstant_0/dout] [get_bd_pins PRNG_AMP_SAMPLING/ResetVal]
connect_bd_net [get_bd_pins xlconstant_1/dout] [get_bd_pins PRNG_EV_SAMPLING/ResetVal]

current_bd_instance /gpio_control
connect_bd_intf_net [get_bd_intf_pins S_AXI1] [get_bd_intf_pins axi_gpio_2/S_AXI]
connect_bd_intf_net [get_bd_intf_pins S_AXI2] [get_bd_intf_pins axi_gpio_3/S_AXI]
connect_bd_intf_net -intf_net zynq_proc_sys_M01_AXI [get_bd_intf_pins S_AXI] [get_bd_intf_pins axi_gpio_0/S_AXI]
connect_bd_intf_net -intf_net zynq_proc_sys_M07_AXI [get_bd_intf_pins S_AXI3] [get_bd_intf_pins axi_gpio_1/S_AXI]
connect_bd_net [get_bd_pins axi_gpio_0/gpio2_io_o] [get_bd_pins gpio2_io_o]
connect_bd_net [get_bd_pins axi_gpio_1/gpio_io_o] [get_bd_pins gpio_io_o3]
connect_bd_net [get_bd_pins axi_gpio_2/gpio_io_o] [get_bd_pins gpio_io_o1]
connect_bd_net [get_bd_pins axi_gpio_3/gpio2_io_o] [get_bd_pins gpio2_io_o2]
connect_bd_net [get_bd_pins axi_gpio_3/gpio_io_o] [get_bd_pins gpio_io_o2]
connect_bd_net -net clk_wiz_0_clk_out2 [get_bd_pins s_axi_aclk] \
  [get_bd_pins axi_gpio_1/s_axi_aclk] [get_bd_pins axi_gpio_2/s_axi_aclk] [get_bd_pins axi_gpio_3/s_axi_aclk] \
  [get_bd_pins axi_gpio_0/s_axi_aclk]
connect_bd_net -net en_1 [get_bd_pins axi_gpio_0/gpio_io_o] [get_bd_pins gpio_io_o]
connect_bd_net -net prng_pulse_generator_done [get_bd_pins gpio2_io_i] [get_bd_pins axi_gpio_2/gpio2_io_i]
connect_bd_net -net proc_sys_reset_1_peripheral_aresetn [get_bd_pins s_axi_aresetn] \
  [get_bd_pins axi_gpio_1/s_axi_aresetn] [get_bd_pins axi_gpio_2/s_axi_aresetn] [get_bd_pins axi_gpio_3/s_axi_aresetn] \
  [get_bd_pins axi_gpio_0/s_axi_aresetn]
connect_bd_net -net target_events_1 [get_bd_pins axi_gpio_1/gpio2_io_o] [get_bd_pins gpio2_io_o1]

current_bd_instance /
connect_bd_intf_net [get_bd_intf_pins axi_bram_ctrl_0/BRAM_PORTA] [get_bd_intf_pins PRNG_PULSE_GEN/BRAM_PORTA]
connect_bd_intf_net [get_bd_intf_pins axi_bram_ctrl_1/BRAM_PORTA] [get_bd_intf_pins PRNG_PULSE_GEN/BRAM_PORTA1]
connect_bd_intf_net [get_bd_intf_pins ps8_0_axi_periph/M00_AXI] [get_bd_intf_pins axi_bram_ctrl_0/S_AXI]
connect_bd_intf_net [get_bd_intf_pins ps8_0_axi_periph/M02_AXI] [get_bd_intf_pins axi_bram_ctrl_1/S_AXI]
connect_bd_intf_net [get_bd_intf_pins ps8_0_axi_periph/M08_AXI] [get_bd_intf_pins gpio_control/S_AXI1]
connect_bd_intf_net [get_bd_intf_pins ps8_0_axi_periph/M09_AXI] [get_bd_intf_pins gpio_control/S_AXI2]
connect_bd_intf_net -intf_net zynq_proc_sys_M01_AXI [get_bd_intf_pins gpio_control/S_AXI] [get_bd_intf_pins ps8_0_axi_periph/M01_AXI]
connect_bd_intf_net -intf_net zynq_proc_sys_M07_AXI [get_bd_intf_pins gpio_control/S_AXI3] [get_bd_intf_pins ps8_0_axi_periph/M07_AXI]
connect_bd_intf_net [get_bd_intf_pins zynq_ultra_ps_e_0/M_AXI_HPM0_LPD] [get_bd_intf_pins ps8_0_axi_periph/S00_AXI]
connect_bd_net -net CDC_Dout [get_bd_pins CDC/adc_data_dpp] [get_bd_pins dacMux/x0]
connect_bd_net [get_bd_pins CDC/dac_data] [get_bd_ports dac_data]
connect_bd_net -net aresetn_1 [get_bd_pins proc_sys_reset_2/peripheral_aresetn] [get_bd_pins PRNG_PULSE_GEN/aresetn] [get_bd_pins CDC/s_aresetn]
connect_bd_net -net axi_gpio_0_gpio2_io_o [get_bd_pins gpio_control/gpio2_io_o] [get_bd_pins dacMux/sel]
connect_bd_net -net axi_gpio_1_gpio_io_o [get_bd_pins gpio_control/gpio_io_o3] [get_bd_pins PRNG_PULSE_GEN/prob_thr]
connect_bd_net -net axi_gpio_2_gpio_io_o [get_bd_pins gpio_control/gpio_io_o1] [get_bd_pins dacMux/x3]
connect_bd_net [get_bd_pins clk_wiz_0/clk_out1] [get_bd_pins proc_sys_reset_0/slowest_sync_clk]
connect_bd_net [get_bd_pins clk_wiz_0/clk_out2] \
  [get_bd_pins CDC/ps_clk] [get_bd_pins proc_sys_reset_1/slowest_sync_clk] [get_bd_pins zynq_ultra_ps_e_0/maxihpm0_lpd_aclk] \
  [get_bd_pins ps8_0_axi_periph/S00_ACLK] [get_bd_pins ps8_0_axi_periph/M00_ACLK] [get_bd_pins ps8_0_axi_periph/M01_ACLK] \
  [get_bd_pins ps8_0_axi_periph/M02_ACLK] [get_bd_pins ps8_0_axi_periph/M03_ACLK] [get_bd_pins ps8_0_axi_periph/M04_ACLK] \
  [get_bd_pins ps8_0_axi_periph/M05_ACLK] [get_bd_pins ps8_0_axi_periph/M06_ACLK] [get_bd_pins ps8_0_axi_periph/ACLK] \
  [get_bd_pins ps8_0_axi_periph/M07_ACLK] [get_bd_pins ps8_0_axi_periph/M08_ACLK] [get_bd_pins ps8_0_axi_periph/M09_ACLK] \
  [get_bd_pins gpio_control/s_axi_aclk] [get_bd_pins axi_bram_ctrl_0/s_axi_aclk] [get_bd_pins axi_bram_ctrl_1/s_axi_aclk]
connect_bd_net [get_bd_pins clk_wiz_0/clk_out3] \
  [get_bd_pins CDC/m_aclk] [get_bd_ports adc_clk] [get_bd_ports dac_clk] [get_bd_pins led_blink_0/clk] \
  [get_bd_pins PRNG_PULSE_GEN/clk] [get_bd_pins proc_sys_reset_2/slowest_sync_clk]
connect_bd_net -net dacMux_0_y [get_bd_pins dacMux/y] [get_bd_pins CDC/dac_data_mux]
connect_bd_net -net en_1 [get_bd_pins gpio_control/gpio_io_o] [get_bd_pins PRNG_PULSE_GEN/en]
connect_bd_net [get_bd_pins gpio_control/gpio2_io_o2] [get_bd_pins PRNG_PULSE_GEN/update_trigger]
connect_bd_net [get_bd_pins gpio_control/gpio_io_o2] [get_bd_pins PRNG_PULSE_GEN/addr_lim]
connect_bd_net -net prng_pulse_generator_bram_sig [get_bd_pins PRNG_PULSE_GEN/bram_sig] [get_bd_pins dacMux/x4]
connect_bd_net -net prng_pulse_generator_dac_data [get_bd_pins PRNG_PULSE_GEN/ramp] [get_bd_pins dacMux/x2]
connect_bd_net -net prng_pulse_generator_done [get_bd_pins PRNG_PULSE_GEN/done] [get_bd_pins gpio_control/gpio2_io_i]
connect_bd_net [get_bd_pins proc_sys_reset_1/peripheral_aresetn] \
  [get_bd_pins ps8_0_axi_periph/S00_ARESETN] [get_bd_pins ps8_0_axi_periph/M00_ARESETN] \
  [get_bd_pins ps8_0_axi_periph/M01_ARESETN] [get_bd_pins ps8_0_axi_periph/M02_ARESETN] \
  [get_bd_pins ps8_0_axi_periph/M03_ARESETN] [get_bd_pins ps8_0_axi_periph/M04_ARESETN] \
  [get_bd_pins ps8_0_axi_periph/M05_ARESETN] [get_bd_pins ps8_0_axi_periph/M06_ARESETN] \
  [get_bd_pins ps8_0_axi_periph/ARESETN] [get_bd_pins ps8_0_axi_periph/M07_ARESETN] \
  [get_bd_pins ps8_0_axi_periph/M08_ARESETN] [get_bd_pins ps8_0_axi_periph/M09_ARESETN] \
  [get_bd_pins gpio_control/s_axi_aresetn] [get_bd_pins axi_bram_ctrl_0/s_axi_aresetn] \
  [get_bd_pins axi_bram_ctrl_1/s_axi_aresetn]
connect_bd_net -net s_axis_tdata_0_1 [get_bd_ports adc_data] [get_bd_pins CDC/adc_data] [get_bd_pins dacMux/x1]
connect_bd_net -net target_events_1 [get_bd_pins gpio_control/gpio2_io_o1] [get_bd_pins PRNG_PULSE_GEN/target_events]
connect_bd_net [get_bd_pins util_vector_logic_0/Res] [get_bd_ports led_0]
connect_bd_net -net xlconstant_1_dout1 [get_bd_pins led_blink_0/led] [get_bd_ports led_1] [get_bd_pins util_vector_logic_0/Op1]
connect_bd_net [get_bd_pins xlslice_0/Dout] [get_bd_ports fan_en_b]
connect_bd_net -net zynq_proc_sys_ext_reset_in [get_bd_pins zynq_ultra_ps_e_0/pl_resetn0] \
  [get_bd_pins clk_wiz_0/resetn] [get_bd_pins proc_sys_reset_0/ext_reset_in] [get_bd_pins proc_sys_reset_1/ext_reset_in] \
  [get_bd_pins rst_ps8_0_99M/ext_reset_in] [get_bd_pins proc_sys_reset_2/ext_reset_in]
connect_bd_net -net zynq_proc_sys_pl_clk0 [get_bd_pins zynq_ultra_ps_e_0/pl_clk0] \
  [get_bd_pins clk_wiz_0/clk_in1] [get_bd_pins rst_ps8_0_99M/slowest_sync_clk]
connect_bd_net [get_bd_pins zynq_ultra_ps_e_0/emio_ttc0_wave_o] [get_bd_pins xlslice_0/Din]
set_property PFM.CLOCK {clk_out1 {id "12" is_default "false" proc_sys_reset "/proc_sys_reset_0" status "fixed" freq_hz "99999000"} clk_out2 {id "9" is_default "true" proc_sys_reset "/proc_sys_reset_1" status "fixed" freq_hz "199998000"}} [get_bd_cells clk_wiz_0]
set_property PFM.AXI_PORT {M_AXI_HPM0_FPD { memport "M_AXI_GP" sptag "" memory "" is_range "false" } M_AXI_HPM1_FPD { memport "M_AXI_GP" sptag "" memory "" is_range "false" } S_AXI_HP0_FPD { memport "S_AXI_HP" sptag "HP0" memory "" is_range "false" } S_AXI_HP1_FPD { memport "S_AXI_HP" sptag "HP1" memory "" is_range "false" } S_AXI_HP2_FPD { memport "S_AXI_HP" sptag "HP2" memory "" is_range "false" } S_AXI_HP3_FPD { memport "S_AXI_HP" sptag "HP3" memory "" is_range "false" } S_AXI_HPC1_FPD { memport "S_AXI_HPC" sptag "HPC1" memory "" is_range "false" } } [get_bd_cells zynq_ultra_ps_e_0]

# ---- address map ----
assign_bd_address -offset 0x0080000000 -range 8K -target_address_space [get_bd_addr_spaces zynq_ultra_ps_e_0/Data] [get_bd_addr_segs axi_bram_ctrl_0/S_AXI/Mem0]
assign_bd_address -offset 0x0080030000 -range 64K -target_address_space [get_bd_addr_spaces zynq_ultra_ps_e_0/Data] [get_bd_addr_segs gpio_control/axi_gpio_0/S_AXI/Reg]
assign_bd_address -offset 0x0080070000 -range 64K -target_address_space [get_bd_addr_spaces zynq_ultra_ps_e_0/Data] [get_bd_addr_segs gpio_control/axi_gpio_1/S_AXI/Reg]
assign_bd_address -offset 0x0080080000 -range 64K -target_address_space [get_bd_addr_spaces zynq_ultra_ps_e_0/Data] [get_bd_addr_segs gpio_control/axi_gpio_2/S_AXI/Reg]
assign_bd_address -offset 0x0080090000 -range 64K -target_address_space [get_bd_addr_spaces zynq_ultra_ps_e_0/Data] [get_bd_addr_segs gpio_control/axi_gpio_3/S_AXI/Reg]
assign_bd_address -offset 0x0082000000 -range 32K -target_address_space [get_bd_addr_spaces zynq_ultra_ps_e_0/Data] [get_bd_addr_segs axi_bram_ctrl_1/S_AXI/Mem0]

validate_bd_design
save_bd_design
